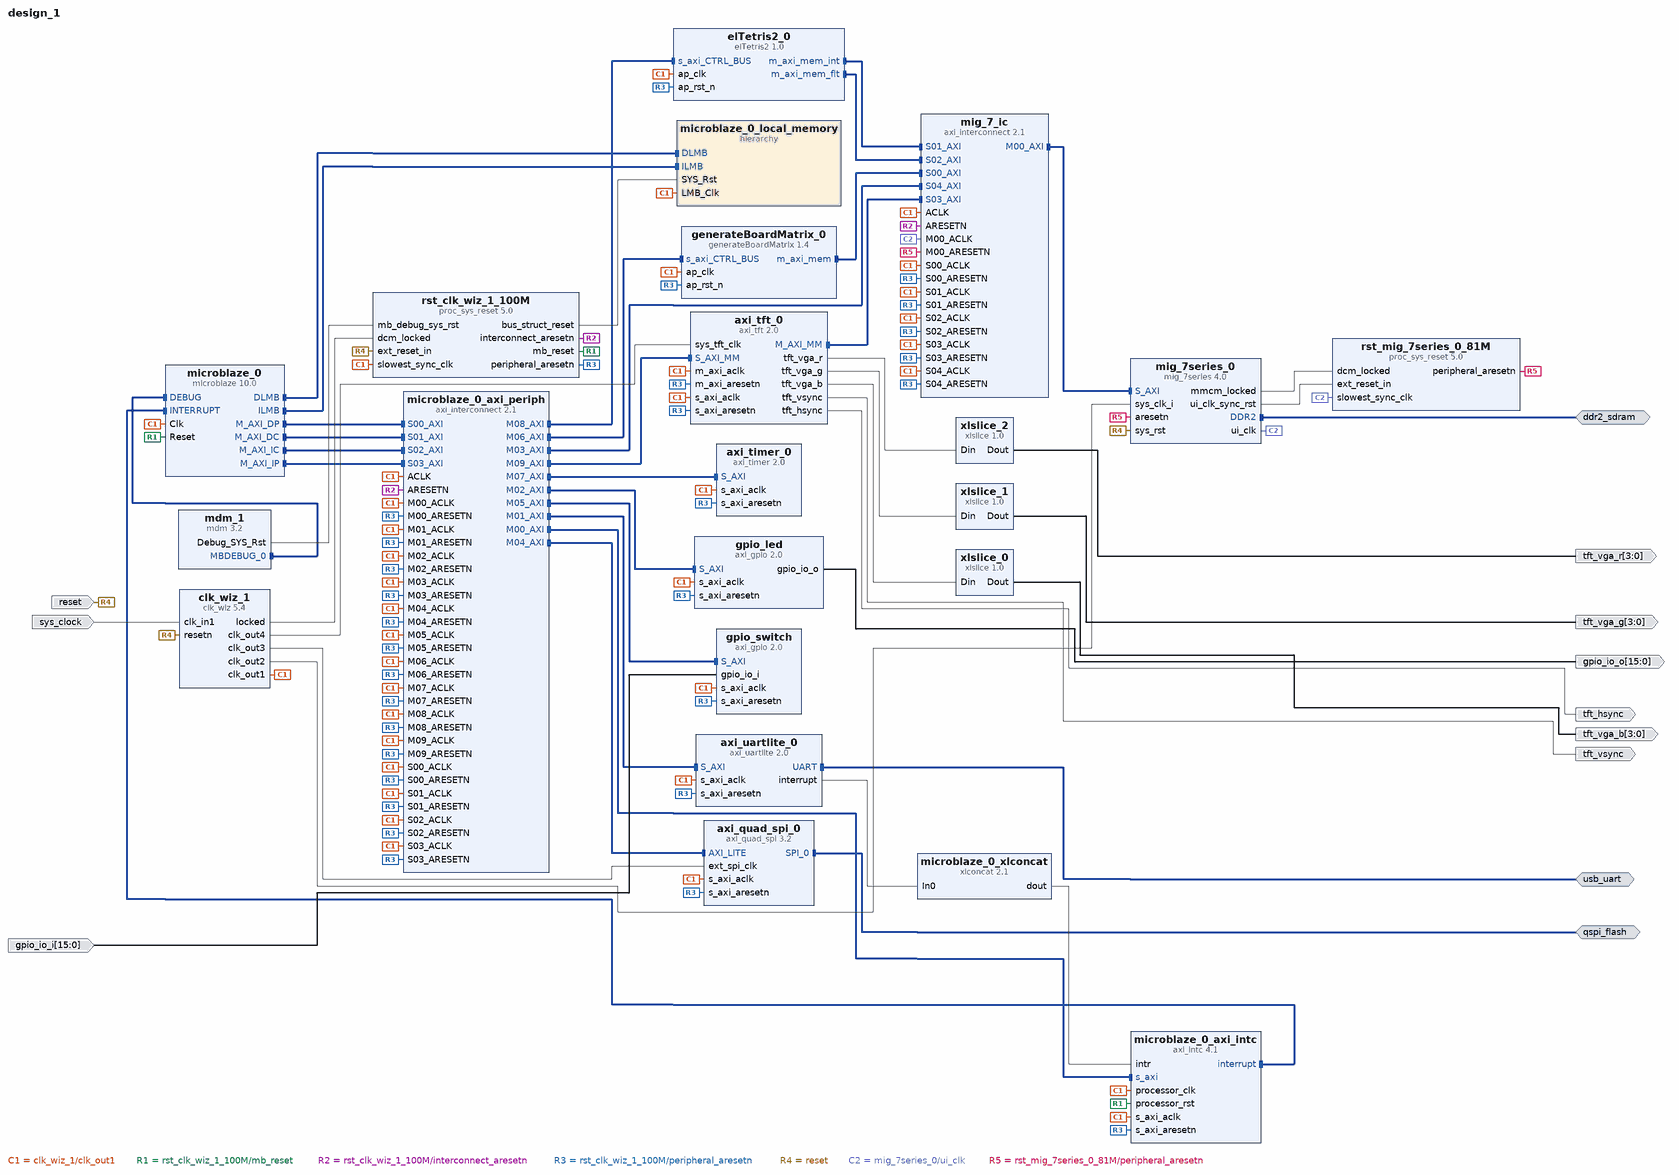
[diagram p0: block diagram of the top level]
# Vivado block design design_1, xc7a100tcsg324-1, Vivado 2017.2
create_bd_design design_1

create_bd_intf_port -mode Master -vlnv xilinx.com:interface:uart_rtl:1.0 usb_uart
create_bd_intf_port -mode Master -vlnv xilinx.com:interface:ddrx_rtl:1.0 ddr2_sdram
create_bd_intf_port -mode Master -vlnv xilinx.com:interface:spi_rtl:1.0 qspi_flash
create_bd_port -dir I -type rst reset
set_property -dict {CONFIG.POLARITY ACTIVE_LOW} [get_bd_ports reset]
create_bd_port -dir I -type clk sys_clock
set_property -dict {CONFIG.FREQ_HZ 100000000 CONFIG.PHASE 0.000} [get_bd_ports sys_clock]
create_bd_port -dir I -from 15 -to 0 gpio_io_i
create_bd_port -dir O -from 15 -to 0 gpio_io_o
create_bd_port -dir O tft_vsync
create_bd_port -dir O tft_hsync
create_bd_port -dir O -from 3 -to 0 tft_vga_b
create_bd_port -dir O -from 3 -to 0 tft_vga_g
create_bd_port -dir O -from 3 -to 0 tft_vga_r

create_bd_cell -type ip -vlnv xilinx.com:ip:microblaze:10.0 microblaze_0
set_property -dict [list \
  CONFIG.C_D_AXI 1 \
  CONFIG.C_D_LMB 1 \
  CONFIG.C_I_AXI 1 \
  CONFIG.C_I_LMB 1 \
  CONFIG.C_USE_BARREL 1 \
  CONFIG.C_USE_DIV 1 \
  CONFIG.C_USE_HW_MUL 1 \
  CONFIG.C_USE_FPU 1 \
  CONFIG.C_DEBUG_ENABLED 1 \
  CONFIG.C_USE_ICACHE 1 \
  CONFIG.C_USE_DCACHE 1 \
  CONFIG.C_DCACHE_ADDR_TAG 14 \
] [get_bd_cells microblaze_0]
create_bd_cell -type hier microblaze_0_local_memory
create_bd_cell -type ip -vlnv xilinx.com:ip:axi_interconnect:2.1 microblaze_0_axi_periph
set_property -dict {CONFIG.NUM_SI 4 CONFIG.NUM_MI 10 CONFIG.M03_HAS_DATA_FIFO 1} [get_bd_cells microblaze_0_axi_periph]
create_bd_cell -type ip -vlnv xilinx.com:ip:axi_intc:4.1 microblaze_0_axi_intc
set_property -dict {CONFIG.C_HAS_FAST 1} [get_bd_cells microblaze_0_axi_intc]
create_bd_cell -type ip -vlnv xilinx.com:ip:xlconcat:2.1 microblaze_0_xlconcat
set_property -dict {CONFIG.NUM_PORTS 1} [get_bd_cells microblaze_0_xlconcat]
create_bd_cell -type ip -vlnv xilinx.com:ip:mdm:3.2 mdm_1
create_bd_cell -type ip -vlnv xilinx.com:ip:clk_wiz:5.4 clk_wiz_1
set_property -dict [list \
  CONFIG.CLKOUT2_USED true \
  CONFIG.CLKOUT3_USED true \
  CONFIG.CLKOUT4_USED true \
  CONFIG.NUM_OUT_CLKS 4 \
  CONFIG.CLKOUT2_REQUESTED_OUT_FREQ 200.000 \
  CONFIG.CLKOUT3_REQUESTED_OUT_FREQ 50.000 \
  CONFIG.CLKOUT4_REQUESTED_OUT_FREQ 25 \
  CONFIG.PRIM_SOURCE Single_ended_clock_capable_pin \
  CONFIG.RESET_PORT resetn \
  CONFIG.MMCM_DIVCLK_DIVIDE 1 \
  CONFIG.MMCM_CLKOUT1_DIVIDE 5 \
  CONFIG.MMCM_CLKOUT2_DIVIDE 20 \
  CONFIG.MMCM_CLKOUT3_DIVIDE 40 \
  CONFIG.RESET_TYPE ACTIVE_LOW \
  CONFIG.USE_BOARD_FLOW true \
  CONFIG.CLK_IN1_BOARD_INTERFACE sys_clock \
  CONFIG.RESET_BOARD_INTERFACE reset \
  CONFIG.CLKOUT2_JITTER 114.829 \
  CONFIG.CLKOUT2_PHASE_ERROR 98.575 \
  CONFIG.CLKOUT3_JITTER 151.636 \
  CONFIG.CLKOUT3_PHASE_ERROR 98.575 \
  CONFIG.CLKOUT4_JITTER 175.402 \
  CONFIG.CLKOUT4_PHASE_ERROR 98.575 \
] [get_bd_cells clk_wiz_1]
create_bd_cell -type ip -vlnv xilinx.com:ip:proc_sys_reset:5.0 rst_clk_wiz_1_100M
set_property -dict {CONFIG.USE_BOARD_FLOW true CONFIG.RESET_BOARD_INTERFACE reset} [get_bd_cells rst_clk_wiz_1_100M]
create_bd_cell -type ip -vlnv xilinx.com:ip:axi_uartlite:2.0 axi_uartlite_0
set_property -dict {CONFIG.USE_BOARD_FLOW true CONFIG.UARTLITE_BOARD_INTERFACE usb_uart} [get_bd_cells axi_uartlite_0]
create_bd_cell -type ip -vlnv xilinx.com:ip:mig_7series:4.0 mig_7series_0
set_property -dict {CONFIG.RESET_BOARD_INTERFACE reset CONFIG.BOARD_MIG_PARAM ddr2_sdram} [get_bd_cells mig_7series_0]
create_bd_cell -type ip -vlnv xilinx.com:ip:proc_sys_reset:5.0 rst_mig_7series_0_81M
create_bd_cell -type ip -vlnv xilinx.com:ip:axi_quad_spi:3.2 axi_quad_spi_0
set_property -dict {CONFIG.USE_BOARD_FLOW true CONFIG.QSPI_BOARD_INTERFACE qspi_flash} [get_bd_cells axi_quad_spi_0]
create_bd_cell -type ip -vlnv xilinx.com:ip:axi_gpio:2.0 gpio_led
set_property -dict [list \
  CONFIG.C_GPIO_WIDTH 16 \
  CONFIG.USE_BOARD_FLOW true \
  CONFIG.GPIO_BOARD_INTERFACE Custom \
  CONFIG.C_ALL_OUTPUTS 1 \
] [get_bd_cells gpio_led]
create_bd_cell -type ip -vlnv xilinx.com:ip:axi_gpio:2.0 gpio_switch
set_property -dict [list \
  CONFIG.C_GPIO_WIDTH 16 \
  CONFIG.C_ALL_INPUTS 1 \
  CONFIG.USE_BOARD_FLOW true \
  CONFIG.GPIO_BOARD_INTERFACE Custom \
] [get_bd_cells gpio_switch]
create_bd_cell -type ip -vlnv xilinx.com:ip:axi_timer:2.0 axi_timer_0
set_property -dict {CONFIG.enable_timer2 0} [get_bd_cells axi_timer_0]
create_bd_cell -type ip -vlnv xilinx.com:ip:axi_tft:2.0 axi_tft_0
set_property -dict {CONFIG.C_EN_I2C_INTF 0 CONFIG.C_TFT_INTERFACE 0} [get_bd_cells axi_tft_0]
create_bd_cell -type ip -vlnv xilinx.com:ip:xlslice:1.0 xlslice_0
set_property -dict {CONFIG.DIN_TO 0 CONFIG.DIN_FROM 3 CONFIG.DIN_WIDTH 6 CONFIG.DOUT_WIDTH 4} [get_bd_cells xlslice_0]
create_bd_cell -type ip -vlnv xilinx.com:ip:xlslice:1.0 xlslice_1
set_property -dict {CONFIG.DIN_TO 0 CONFIG.DIN_FROM 3 CONFIG.DIN_WIDTH 6 CONFIG.DOUT_WIDTH 4} [get_bd_cells xlslice_1]
create_bd_cell -type ip -vlnv xilinx.com:ip:xlslice:1.0 xlslice_2
set_property -dict {CONFIG.DIN_TO 0 CONFIG.DIN_FROM 3 CONFIG.DIN_WIDTH 6 CONFIG.DOUT_WIDTH 4} [get_bd_cells xlslice_2]
create_bd_cell -type ip -vlnv xilinx.com:elTetris2:elTetris2:1.0 elTetris2_0
create_bd_cell -type ip -vlnv xilinx.com:ip:axi_interconnect:2.1 mig_7_ic
set_property -dict [list \
  CONFIG.NUM_SI 5 \
  CONFIG.NUM_MI 1 \
  CONFIG.M00_HAS_REGSLICE 3 \
  CONFIG.M00_HAS_DATA_FIFO 2 \
  CONFIG.S00_HAS_REGSLICE 0 \
  CONFIG.S01_HAS_REGSLICE 0 \
  CONFIG.S02_HAS_REGSLICE 0 \
  CONFIG.S00_HAS_DATA_FIFO 1 \
  CONFIG.S01_HAS_DATA_FIFO 1 \
  CONFIG.S02_HAS_DATA_FIFO 1 \
  CONFIG.S03_HAS_DATA_FIFO 1 \
  CONFIG.S04_HAS_DATA_FIFO 1 \
] [get_bd_cells mig_7_ic]
create_bd_cell -type ip -vlnv xilinx.com:TetrisPlacementCore:generateBoardMatrix:1.4 generateBoardMatrix_0

# ---- hierarchy /microblaze_0_local_memory ----
current_bd_instance /microblaze_0_local_memory
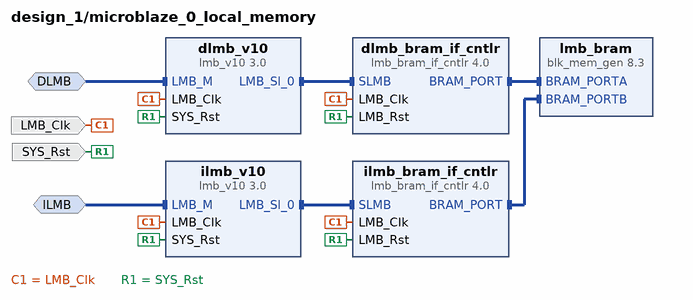
[diagram p1: block diagram inside /microblaze_0_local_memory]
create_bd_intf_pin -mode MirroredMaster -vlnv xilinx.com:interface:lmb_rtl:1.0 DLMB
create_bd_intf_pin -mode MirroredMaster -vlnv xilinx.com:interface:lmb_rtl:1.0 ILMB
create_bd_pin -dir I -type clk LMB_Clk
create_bd_pin -dir I -type rst SYS_Rst

create_bd_cell -type ip -vlnv xilinx.com:ip:lmb_v10:3.0 dlmb_v10
create_bd_cell -type ip -vlnv xilinx.com:ip:lmb_v10:3.0 ilmb_v10
create_bd_cell -type ip -vlnv xilinx.com:ip:lmb_bram_if_cntlr:4.0 dlmb_bram_if_cntlr
set_property -dict {CONFIG.C_ECC 0} [get_bd_cells dlmb_bram_if_cntlr]
create_bd_cell -type ip -vlnv xilinx.com:ip:lmb_bram_if_cntlr:4.0 ilmb_bram_if_cntlr
set_property -dict {CONFIG.C_ECC 0} [get_bd_cells ilmb_bram_if_cntlr]
create_bd_cell -type ip -vlnv xilinx.com:ip:blk_mem_gen:8.3 lmb_bram
set_property -dict {CONFIG.Memory_Type True_Dual_Port_RAM CONFIG.use_bram_block BRAM_Controller} [get_bd_cells lmb_bram]

# ---- connections ----

current_bd_instance /microblaze_0_local_memory
connect_bd_intf_net -intf_net microblaze_0_dlmb_bus [get_bd_intf_pins dlmb_v10/LMB_Sl_0] [get_bd_intf_pins dlmb_bram_if_cntlr/SLMB]
connect_bd_intf_net -intf_net microblaze_0_ilmb_bus [get_bd_intf_pins ilmb_v10/LMB_Sl_0] [get_bd_intf_pins ilmb_bram_if_cntlr/SLMB]
connect_bd_intf_net -intf_net microblaze_0_dlmb_cntlr [get_bd_intf_pins dlmb_bram_if_cntlr/BRAM_PORT] [get_bd_intf_pins lmb_bram/BRAM_PORTA]
connect_bd_intf_net -intf_net microblaze_0_ilmb_cntlr [get_bd_intf_pins ilmb_bram_if_cntlr/BRAM_PORT] [get_bd_intf_pins lmb_bram/BRAM_PORTB]
connect_bd_intf_net -intf_net microblaze_0_dlmb [get_bd_intf_pins DLMB] [get_bd_intf_pins dlmb_v10/LMB_M]
connect_bd_intf_net -intf_net microblaze_0_ilmb [get_bd_intf_pins ILMB] [get_bd_intf_pins ilmb_v10/LMB_M]
connect_bd_net -net microblaze_0_Clk [get_bd_pins LMB_Clk] \
  [get_bd_pins dlmb_v10/LMB_Clk] [get_bd_pins dlmb_bram_if_cntlr/LMB_Clk] [get_bd_pins ilmb_v10/LMB_Clk] \
  [get_bd_pins ilmb_bram_if_cntlr/LMB_Clk]
connect_bd_net [get_bd_pins SYS_Rst] \
  [get_bd_pins dlmb_v10/SYS_Rst] [get_bd_pins dlmb_bram_if_cntlr/LMB_Rst] [get_bd_pins ilmb_v10/SYS_Rst] \
  [get_bd_pins ilmb_bram_if_cntlr/LMB_Rst]

current_bd_instance /
connect_bd_intf_net [get_bd_intf_pins microblaze_0/DLMB] [get_bd_intf_pins microblaze_0_local_memory/DLMB]
connect_bd_intf_net [get_bd_intf_pins microblaze_0/ILMB] [get_bd_intf_pins microblaze_0_local_memory/ILMB]
connect_bd_intf_net -intf_net microblaze_0_axi_dp [get_bd_intf_pins microblaze_0_axi_periph/S00_AXI] [get_bd_intf_pins microblaze_0/M_AXI_DP]
connect_bd_intf_net [get_bd_intf_pins microblaze_0_axi_intc/interrupt] [get_bd_intf_pins microblaze_0/INTERRUPT]
connect_bd_intf_net -intf_net microblaze_0_intc_axi [get_bd_intf_pins microblaze_0_axi_periph/M00_AXI] [get_bd_intf_pins microblaze_0_axi_intc/s_axi]
connect_bd_intf_net [get_bd_intf_pins mdm_1/MBDEBUG_0] [get_bd_intf_pins microblaze_0/DEBUG]
connect_bd_intf_net [get_bd_intf_pins microblaze_0/M_AXI_DC] [get_bd_intf_pins microblaze_0_axi_periph/S01_AXI]
connect_bd_intf_net [get_bd_intf_pins microblaze_0/M_AXI_IC] [get_bd_intf_pins microblaze_0_axi_periph/S02_AXI]
connect_bd_intf_net [get_bd_intf_pins microblaze_0_axi_periph/M01_AXI] [get_bd_intf_pins axi_uartlite_0/S_AXI]
connect_bd_intf_net [get_bd_intf_pins microblaze_0/M_AXI_IP] [get_bd_intf_pins microblaze_0_axi_periph/S03_AXI]
connect_bd_intf_net [get_bd_intf_pins microblaze_0_axi_periph/M04_AXI] [get_bd_intf_pins axi_quad_spi_0/AXI_LITE]
connect_bd_intf_net [get_bd_intf_pins microblaze_0_axi_periph/M02_AXI] [get_bd_intf_pins gpio_led/S_AXI]
connect_bd_intf_net [get_bd_intf_pins microblaze_0_axi_periph/M05_AXI] [get_bd_intf_pins gpio_switch/S_AXI]
connect_bd_intf_net [get_bd_intf_pins microblaze_0_axi_periph/M06_AXI] [get_bd_intf_pins generateBoardMatrix_0/s_axi_CTRL_BUS]
connect_bd_intf_net [get_bd_intf_pins microblaze_0_axi_periph/M07_AXI] [get_bd_intf_pins axi_timer_0/S_AXI]
connect_bd_intf_net [get_bd_intf_pins microblaze_0_axi_periph/M09_AXI] [get_bd_intf_pins axi_tft_0/S_AXI_MM]
connect_bd_intf_net [get_bd_intf_pins microblaze_0_axi_periph/M08_AXI] [get_bd_intf_pins elTetris2_0/s_axi_CTRL_BUS]
connect_bd_intf_net [get_bd_intf_pins generateBoardMatrix_0/m_axi_mem] [get_bd_intf_pins mig_7_ic/S00_AXI]
connect_bd_intf_net [get_bd_intf_pins elTetris2_0/m_axi_mem_int] [get_bd_intf_pins mig_7_ic/S01_AXI]
connect_bd_intf_net [get_bd_intf_pins elTetris2_0/m_axi_mem_flt] [get_bd_intf_pins mig_7_ic/S02_AXI]
connect_bd_intf_net -intf_net axi_interconnect_0_M00_AXI [get_bd_intf_pins mig_7series_0/S_AXI] [get_bd_intf_pins mig_7_ic/M00_AXI]
connect_bd_intf_net [get_bd_intf_pins axi_tft_0/M_AXI_MM] [get_bd_intf_pins mig_7_ic/S03_AXI]
connect_bd_intf_net [get_bd_intf_pins microblaze_0_axi_periph/M03_AXI] [get_bd_intf_pins mig_7_ic/S04_AXI]
connect_bd_intf_net [get_bd_intf_ports usb_uart] [get_bd_intf_pins axi_uartlite_0/UART]
connect_bd_intf_net [get_bd_intf_ports ddr2_sdram] [get_bd_intf_pins mig_7series_0/DDR2]
connect_bd_intf_net [get_bd_intf_ports qspi_flash] [get_bd_intf_pins axi_quad_spi_0/SPI_0]
connect_bd_net -net microblaze_0_intr [get_bd_pins microblaze_0_xlconcat/dout] [get_bd_pins microblaze_0_axi_intc/intr]
connect_bd_net -net microblaze_0_Clk [get_bd_pins clk_wiz_1/clk_out1] \
  [get_bd_pins microblaze_0/Clk] [get_bd_pins microblaze_0_axi_intc/s_axi_aclk] \
  [get_bd_pins microblaze_0_axi_intc/processor_clk] [get_bd_pins rst_clk_wiz_1_100M/slowest_sync_clk] \
  [get_bd_pins axi_uartlite_0/s_axi_aclk] [get_bd_pins axi_quad_spi_0/s_axi_aclk] [get_bd_pins gpio_led/s_axi_aclk] \
  [get_bd_pins gpio_switch/s_axi_aclk] [get_bd_pins axi_timer_0/s_axi_aclk] [get_bd_pins axi_tft_0/s_axi_aclk] \
  [get_bd_pins axi_tft_0/m_axi_aclk] [get_bd_pins elTetris2_0/ap_clk] [get_bd_pins microblaze_0_axi_periph/ACLK] \
  [get_bd_pins microblaze_0_axi_periph/S00_ACLK] [get_bd_pins microblaze_0_axi_periph/M00_ACLK] \
  [get_bd_pins microblaze_0_local_memory/LMB_Clk] [get_bd_pins microblaze_0_axi_periph/S01_ACLK] \
  [get_bd_pins microblaze_0_axi_periph/S02_ACLK] [get_bd_pins microblaze_0_axi_periph/M01_ACLK] \
  [get_bd_pins microblaze_0_axi_periph/M02_ACLK] [get_bd_pins microblaze_0_axi_periph/S03_ACLK] \
  [get_bd_pins microblaze_0_axi_periph/M04_ACLK] [get_bd_pins microblaze_0_axi_periph/M05_ACLK] \
  [get_bd_pins microblaze_0_axi_periph/M06_ACLK] [get_bd_pins microblaze_0_axi_periph/M07_ACLK] \
  [get_bd_pins microblaze_0_axi_periph/M08_ACLK] [get_bd_pins microblaze_0_axi_periph/M09_ACLK] \
  [get_bd_pins microblaze_0_axi_periph/M03_ACLK] [get_bd_pins mig_7_ic/S04_ACLK] [get_bd_pins mig_7_ic/ACLK] \
  [get_bd_pins mig_7_ic/S00_ACLK] [get_bd_pins mig_7_ic/S01_ACLK] [get_bd_pins mig_7_ic/S02_ACLK] \
  [get_bd_pins mig_7_ic/S03_ACLK] [get_bd_pins generateBoardMatrix_0/ap_clk]
connect_bd_net [get_bd_pins clk_wiz_1/locked] [get_bd_pins rst_clk_wiz_1_100M/dcm_locked]
connect_bd_net [get_bd_pins rst_clk_wiz_1_100M/mb_reset] [get_bd_pins microblaze_0/Reset] [get_bd_pins microblaze_0_axi_intc/processor_rst]
connect_bd_net [get_bd_pins rst_clk_wiz_1_100M/bus_struct_reset] [get_bd_pins microblaze_0_local_memory/SYS_Rst]
connect_bd_net [get_bd_pins rst_clk_wiz_1_100M/interconnect_aresetn] [get_bd_pins microblaze_0_axi_periph/ARESETN] [get_bd_pins mig_7_ic/ARESETN]
connect_bd_net [get_bd_pins rst_clk_wiz_1_100M/peripheral_aresetn] \
  [get_bd_pins microblaze_0_axi_intc/s_axi_aresetn] [get_bd_pins axi_uartlite_0/s_axi_aresetn] \
  [get_bd_pins axi_quad_spi_0/s_axi_aresetn] [get_bd_pins gpio_led/s_axi_aresetn] [get_bd_pins gpio_switch/s_axi_aresetn] \
  [get_bd_pins axi_timer_0/s_axi_aresetn] [get_bd_pins axi_tft_0/s_axi_aresetn] [get_bd_pins axi_tft_0/m_axi_aresetn] \
  [get_bd_pins elTetris2_0/ap_rst_n] [get_bd_pins microblaze_0_axi_periph/S00_ARESETN] \
  [get_bd_pins microblaze_0_axi_periph/M00_ARESETN] [get_bd_pins microblaze_0_axi_periph/S01_ARESETN] \
  [get_bd_pins microblaze_0_axi_periph/S02_ARESETN] [get_bd_pins microblaze_0_axi_periph/M01_ARESETN] \
  [get_bd_pins microblaze_0_axi_periph/M02_ARESETN] [get_bd_pins microblaze_0_axi_periph/S03_ARESETN] \
  [get_bd_pins microblaze_0_axi_periph/M04_ARESETN] [get_bd_pins microblaze_0_axi_periph/M05_ARESETN] \
  [get_bd_pins microblaze_0_axi_periph/M06_ARESETN] [get_bd_pins microblaze_0_axi_periph/M07_ARESETN] \
  [get_bd_pins microblaze_0_axi_periph/M08_ARESETN] [get_bd_pins microblaze_0_axi_periph/M09_ARESETN] \
  [get_bd_pins mig_7_ic/S04_ARESETN] [get_bd_pins mig_7_ic/S00_ARESETN] [get_bd_pins mig_7_ic/S01_ARESETN] \
  [get_bd_pins mig_7_ic/S02_ARESETN] [get_bd_pins mig_7_ic/S03_ARESETN] [get_bd_pins microblaze_0_axi_periph/M03_ARESETN] \
  [get_bd_pins generateBoardMatrix_0/ap_rst_n]
connect_bd_net [get_bd_pins mdm_1/Debug_SYS_Rst] [get_bd_pins rst_clk_wiz_1_100M/mb_debug_sys_rst]
connect_bd_net [get_bd_pins axi_uartlite_0/interrupt] [get_bd_pins microblaze_0_xlconcat/In0]
connect_bd_net [get_bd_ports reset] [get_bd_pins rst_clk_wiz_1_100M/ext_reset_in] [get_bd_pins clk_wiz_1/resetn] [get_bd_pins mig_7series_0/sys_rst]
connect_bd_net [get_bd_ports sys_clock] [get_bd_pins clk_wiz_1/clk_in1]
connect_bd_net [get_bd_pins mig_7series_0/ui_clk] [get_bd_pins rst_mig_7series_0_81M/slowest_sync_clk] [get_bd_pins mig_7_ic/M00_ACLK]
connect_bd_net [get_bd_pins mig_7series_0/mmcm_locked] [get_bd_pins rst_mig_7series_0_81M/dcm_locked]
connect_bd_net [get_bd_pins mig_7series_0/ui_clk_sync_rst] [get_bd_pins rst_mig_7series_0_81M/ext_reset_in]
connect_bd_net [get_bd_pins rst_mig_7series_0_81M/peripheral_aresetn] [get_bd_pins mig_7series_0/aresetn] [get_bd_pins mig_7_ic/M00_ARESETN]
connect_bd_net [get_bd_pins clk_wiz_1/clk_out2] [get_bd_pins mig_7series_0/sys_clk_i]
connect_bd_net [get_bd_pins clk_wiz_1/clk_out3] [get_bd_pins axi_quad_spi_0/ext_spi_clk]
connect_bd_net [get_bd_ports gpio_io_i] [get_bd_pins gpio_switch/gpio_io_i]
connect_bd_net [get_bd_pins gpio_led/gpio_io_o] [get_bd_ports gpio_io_o]
connect_bd_net [get_bd_pins axi_tft_0/tft_vga_b] [get_bd_pins xlslice_0/Din]
connect_bd_net [get_bd_pins axi_tft_0/tft_vga_g] [get_bd_pins xlslice_1/Din]
connect_bd_net [get_bd_pins axi_tft_0/tft_vga_r] [get_bd_pins xlslice_2/Din]
connect_bd_net [get_bd_pins clk_wiz_1/clk_out4] [get_bd_pins axi_tft_0/sys_tft_clk]
connect_bd_net [get_bd_pins axi_tft_0/tft_vsync] [get_bd_ports tft_vsync]
connect_bd_net [get_bd_pins axi_tft_0/tft_hsync] [get_bd_ports tft_hsync]
connect_bd_net [get_bd_pins xlslice_0/Dout] [get_bd_ports tft_vga_b]
connect_bd_net [get_bd_pins xlslice_1/Dout] [get_bd_ports tft_vga_g]
connect_bd_net [get_bd_pins xlslice_2/Dout] [get_bd_ports tft_vga_r]

# ---- address map ----
assign_bd_address -offset 0x80000000 -range 128M -target_address_space [get_bd_addr_spaces axi_tft_0/Video_data] [get_bd_addr_segs mig_7series_0/memmap/memaddr]
exclude_bd_addr_seg -offset 0x40000000 -range 64K -target_address_space [get_bd_addr_spaces axi_tft_0/Video_data] [get_bd_addr_segs gpio_led/S_AXI/Reg]
exclude_bd_addr_seg -offset 0x40010000 -range 64K -target_address_space [get_bd_addr_spaces axi_tft_0/Video_data] [get_bd_addr_segs gpio_switch/S_AXI/Reg]
exclude_bd_addr_seg -offset 0x40600000 -range 64K -target_address_space [get_bd_addr_spaces axi_tft_0/Video_data] [get_bd_addr_segs axi_uartlite_0/S_AXI/Reg]
exclude_bd_addr_seg -offset 0x41200000 -range 64K -target_address_space [get_bd_addr_spaces axi_tft_0/Video_data] [get_bd_addr_segs microblaze_0_axi_intc/S_AXI/Reg]
exclude_bd_addr_seg -offset 0x41C00000 -range 64K -target_address_space [get_bd_addr_spaces axi_tft_0/Video_data] [get_bd_addr_segs axi_timer_0/S_AXI/Reg]
exclude_bd_addr_seg -offset 0x44A00000 -range 64K -target_address_space [get_bd_addr_spaces axi_tft_0/Video_data] [get_bd_addr_segs axi_quad_spi_0/AXI_LITE/Reg]
exclude_bd_addr_seg -offset 0x44A10000 -range 64K -target_address_space [get_bd_addr_spaces axi_tft_0/Video_data] [get_bd_addr_segs generateBoardMatrix_0/s_axi_CTRL_BUS/Reg]
exclude_bd_addr_seg -offset 0x44A20000 -range 64K -target_address_space [get_bd_addr_spaces axi_tft_0/Video_data] [get_bd_addr_segs elTetris2_0/s_axi_CTRL_BUS/Reg]
exclude_bd_addr_seg -offset 0x44A30000 -range 64K -target_address_space [get_bd_addr_spaces axi_tft_0/Video_data] [get_bd_addr_segs axi_tft_0/S_AXI_MM/Reg]
assign_bd_address -offset 0x80000000 -range 128M -target_address_space [get_bd_addr_spaces elTetris2_0/Data_m_axi_mem_flt] [get_bd_addr_segs mig_7series_0/memmap/memaddr]
exclude_bd_addr_seg -offset 0x44A30000 -range 64K -target_address_space [get_bd_addr_spaces elTetris2_0/Data_m_axi_mem_flt] [get_bd_addr_segs axi_tft_0/S_AXI_MM/Reg]
assign_bd_address -offset 0x80000000 -range 128M -target_address_space [get_bd_addr_spaces elTetris2_0/Data_m_axi_mem_int] [get_bd_addr_segs mig_7series_0/memmap/memaddr]
exclude_bd_addr_seg -offset 0x44A30000 -range 64K -target_address_space [get_bd_addr_spaces elTetris2_0/Data_m_axi_mem_int] [get_bd_addr_segs axi_tft_0/S_AXI_MM/Reg]
assign_bd_address -offset 0x80000000 -range 128M -target_address_space [get_bd_addr_spaces generateBoardMatrix_0/Data_m_axi_mem] [get_bd_addr_segs mig_7series_0/memmap/memaddr]
exclude_bd_addr_seg -offset 0x41C00000 -range 64K -target_address_space [get_bd_addr_spaces generateBoardMatrix_0/Data_m_axi_mem] [get_bd_addr_segs axi_timer_0/S_AXI/Reg]
exclude_bd_addr_seg -offset 0x44A30000 -range 64K -target_address_space [get_bd_addr_spaces generateBoardMatrix_0/Data_m_axi_mem] [get_bd_addr_segs axi_tft_0/S_AXI_MM/Reg]
assign_bd_address -offset 0x00000000 -range 128K -target_address_space [get_bd_addr_spaces microblaze_0/Data] [get_bd_addr_segs microblaze_0_local_memory/dlmb_bram_if_cntlr/SLMB/Mem]
assign_bd_address -offset 0x40000000 -range 64K -target_address_space [get_bd_addr_spaces microblaze_0/Data] [get_bd_addr_segs gpio_led/S_AXI/Reg]
assign_bd_address -offset 0x40010000 -range 64K -target_address_space [get_bd_addr_spaces microblaze_0/Data] [get_bd_addr_segs gpio_switch/S_AXI/Reg]
assign_bd_address -offset 0x40600000 -range 64K -target_address_space [get_bd_addr_spaces microblaze_0/Data] [get_bd_addr_segs axi_uartlite_0/S_AXI/Reg]
assign_bd_address -offset 0x41200000 -range 64K -target_address_space [get_bd_addr_spaces microblaze_0/Data] [get_bd_addr_segs microblaze_0_axi_intc/S_AXI/Reg]
assign_bd_address -offset 0x41C00000 -range 64K -target_address_space [get_bd_addr_spaces microblaze_0/Data] [get_bd_addr_segs axi_timer_0/S_AXI/Reg]
assign_bd_address -offset 0x44A00000 -range 64K -target_address_space [get_bd_addr_spaces microblaze_0/Data] [get_bd_addr_segs axi_quad_spi_0/AXI_LITE/Reg]
assign_bd_address -offset 0x44A10000 -range 64K -target_address_space [get_bd_addr_spaces microblaze_0/Data] [get_bd_addr_segs generateBoardMatrix_0/s_axi_CTRL_BUS/Reg]
assign_bd_address -offset 0x44A20000 -range 64K -target_address_space [get_bd_addr_spaces microblaze_0/Data] [get_bd_addr_segs elTetris2_0/s_axi_CTRL_BUS/Reg]
assign_bd_address -offset 0x44A30000 -range 64K -target_address_space [get_bd_addr_spaces microblaze_0/Data] [get_bd_addr_segs axi_tft_0/S_AXI_MM/Reg]
assign_bd_address -offset 0x80000000 -range 128M -target_address_space [get_bd_addr_spaces microblaze_0/Data] [get_bd_addr_segs mig_7series_0/memmap/memaddr]
assign_bd_address -offset 0x00000000 -range 128K -target_address_space [get_bd_addr_spaces microblaze_0/Instruction] [get_bd_addr_segs microblaze_0_local_memory/ilmb_bram_if_cntlr/SLMB/Mem]
assign_bd_address -offset 0x40000000 -range 64K -target_address_space [get_bd_addr_spaces microblaze_0/Instruction] [get_bd_addr_segs gpio_led/S_AXI/Reg]
assign_bd_address -offset 0x40010000 -range 64K -target_address_space [get_bd_addr_spaces microblaze_0/Instruction] [get_bd_addr_segs gpio_switch/S_AXI/Reg]
assign_bd_address -offset 0x41C00000 -range 64K -target_address_space [get_bd_addr_spaces microblaze_0/Instruction] [get_bd_addr_segs axi_timer_0/S_AXI/Reg]
assign_bd_address -offset 0x44A10000 -range 64K -target_address_space [get_bd_addr_spaces microblaze_0/Instruction] [get_bd_addr_segs generateBoardMatrix_0/s_axi_CTRL_BUS/Reg]
assign_bd_address -offset 0x44A20000 -range 64K -target_address_space [get_bd_addr_spaces microblaze_0/Instruction] [get_bd_addr_segs elTetris2_0/s_axi_CTRL_BUS/Reg]
assign_bd_address -offset 0x44A30000 -range 64K -target_address_space [get_bd_addr_spaces microblaze_0/Instruction] [get_bd_addr_segs axi_tft_0/S_AXI_MM/Reg]
assign_bd_address -offset 0x80000000 -range 128M -target_address_space [get_bd_addr_spaces microblaze_0/Instruction] [get_bd_addr_segs mig_7series_0/memmap/memaddr]
exclude_bd_addr_seg -offset 0x40600000 -range 64K -target_address_space [get_bd_addr_spaces microblaze_0/Instruction] [get_bd_addr_segs axi_uartlite_0/S_AXI/Reg]
exclude_bd_addr_seg -offset 0x41200000 -range 64K -target_address_space [get_bd_addr_spaces microblaze_0/Instruction] [get_bd_addr_segs microblaze_0_axi_intc/S_AXI/Reg]
exclude_bd_addr_seg -offset 0x44A00000 -range 64K -target_address_space [get_bd_addr_spaces microblaze_0/Instruction] [get_bd_addr_segs axi_quad_spi_0/AXI_LITE/Reg]

validate_bd_design
save_bd_design
